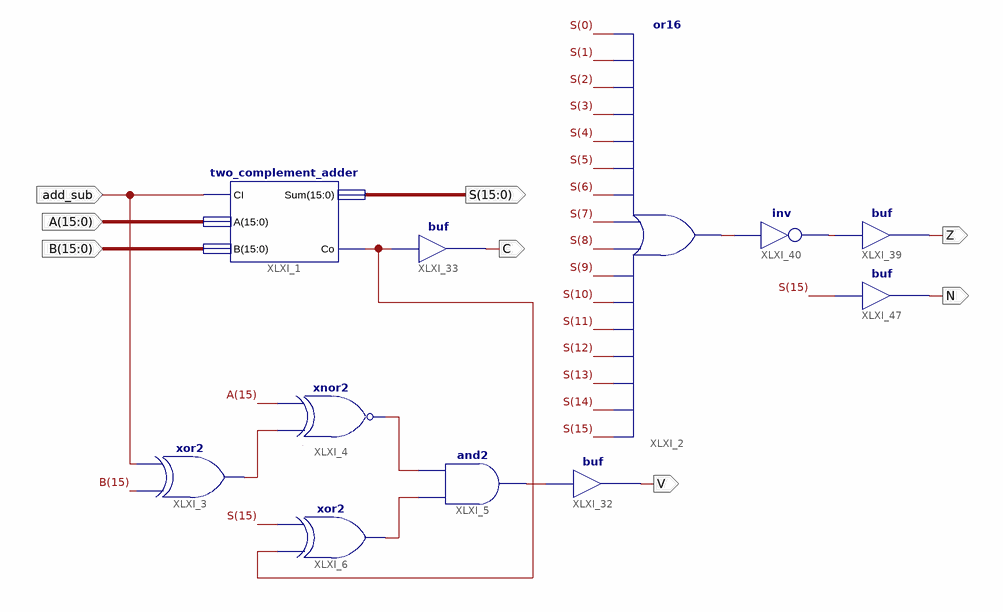
[diagram p0: schematic sheet 1]
// Xilinx ISE schematic ALU16bit.sch (spartan6) as structural Verilog: 11 symbols, 8 ports
module ALU16bit (
  input  add_sub,
  input  [15:0] A,
  input  [15:0] B,
  output C,
  output [15:0] S,
  output V,
  output Z,
  output N
);

  wire XLXN_3, XLXN_4, XLXN_5, XLXN_6, XLXN_22, XLXN_24, XLXN_25;

  two_complement_adder XLXI_1 (.CI(add_sub), .A(A), .B(B), .Sum(S), .Co(XLXN_22));
  buf XLXI_33 (C, XLXN_22);
  xor XLXI_3 (XLXN_3, B[15], add_sub);
  xor XLXI_6 (XLXN_5, XLXN_22, S[15]);
  and XLXI_5 (XLXN_6, XLXN_5, XLXN_4);
  xnor XLXI_4 (XLXN_4, XLXN_3, A[15]);
  buf XLXI_32 (V, XLXN_6);
  or XLXI_2 (XLXN_24, S[15], S[14], S[13], S[12], S[11], S[10], S[9], S[8], S[7], S[6], S[5], S[4], S[3], S[2], S[1], S[0]);
  buf XLXI_39 (Z, XLXN_25);
  not XLXI_40 (XLXN_25, XLXN_24);
  buf XLXI_47 (N, S[15]);
endmodule
